# EAGLE design fameboy_button_pads (EAGLE 7.6.0)
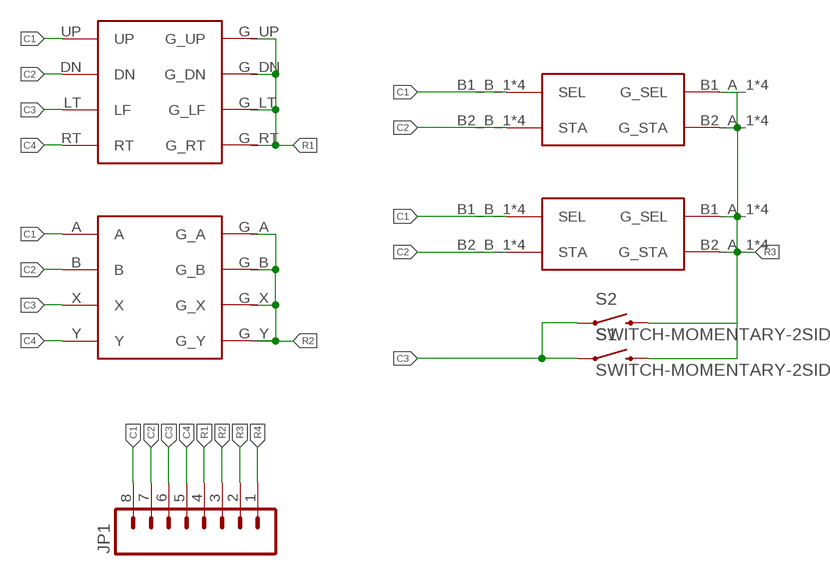
[diagram p0: schematic, sheet 1]

## Parts
JP1  M08  [1X08_ROUND]
S1  SWITCH-MOMENTARY-2SIDE  [TACTILE-PTH-SIDE]
S2  SWITCH-MOMENTARY-2SIDE  [TACTILE-PTH-SIDE]
U$1  DPADGAMEBOY_CLASSIC_DPAD  [DPAD]
U$2  BAXY  [ABXY]
U$3  SELECTSTART  [SELECTSTART]
U$4  SELECTSTART  [SELECTSTART]

## Nets
C1: JP1.8 U$1.UP U$2.A U$3.B1_B_1(SEL) U$3.B1_B_2(SEL) U$3.B1_B_3(SEL) U$3.B1_B_4(SEL) U$4.B1_B_1(SEL) U$4.B1_B_2(SEL) U$4.B1_B_3(SEL) U$4.B1_B_4(SEL)
C2: JP1.7 U$1.DN U$2.B U$3.B2_B_1(STA) U$3.B2_B_2(STA) U$3.B2_B_3(STA) U$3.B2_B_4(STA) U$4.B2_B_1(STA) U$4.B2_B_2(STA) U$4.B2_B_3(STA) U$4.B2_B_4(STA)
C3: JP1.6 S1.1 S2.1 U$1.LT(LF) U$2.X
C4: JP1.5 U$1.RT U$2.Y
R1: JP1.4 U$1.G_DN U$1.G_LT(G_LF) U$1.G_RT U$1.G_UP
R2: JP1.3 U$2.G_A U$2.G_B U$2.G_X U$2.G_Y
R3: JP1.2 S1.2 S2.2 U$3.B1_A_1(G_SEL) U$3.B1_A_2(G_SEL) U$3.B1_A_3(G_SEL) U$3.B1_A_4(G_SEL) U$3.B2_A_1(G_STA) U$3.B2_A_2(G_STA) U$3.B2_A_3(G_STA) U$3.B2_A_4(G_STA) U$4.B1_A_1(G_SEL) U$4.B1_A_2(G_SEL) U$4.B1_A_3(G_SEL) U$4.B1_A_4(G_SEL) U$4.B2_A_1(G_STA) U$4.B2_A_2(G_STA) U$4.B2_A_3(G_STA) U$4.B2_A_4(G_STA)
R4: JP1.1

## Library data of the parts
JP1 = SparkFun-Connectors:M08: Header 8 Standard 8-pin 0.1" header. Use with straight break away headers (SKU : PRT-00116), right angle break away headers (PRT-00553), swiss pins (PRT-00743), machine pins (PRT-00117), and female headers (PRT-00115).
S1 S2 = SparkFun-Electromechanical:SWITCH-MOMENTARY-2: Various NO switches- pushbuttons, reed, etc
U$1 = parts:DPAD
U$2 = parts:BAXY
U$3 U$4 = parts:SELECTSTART

## Board
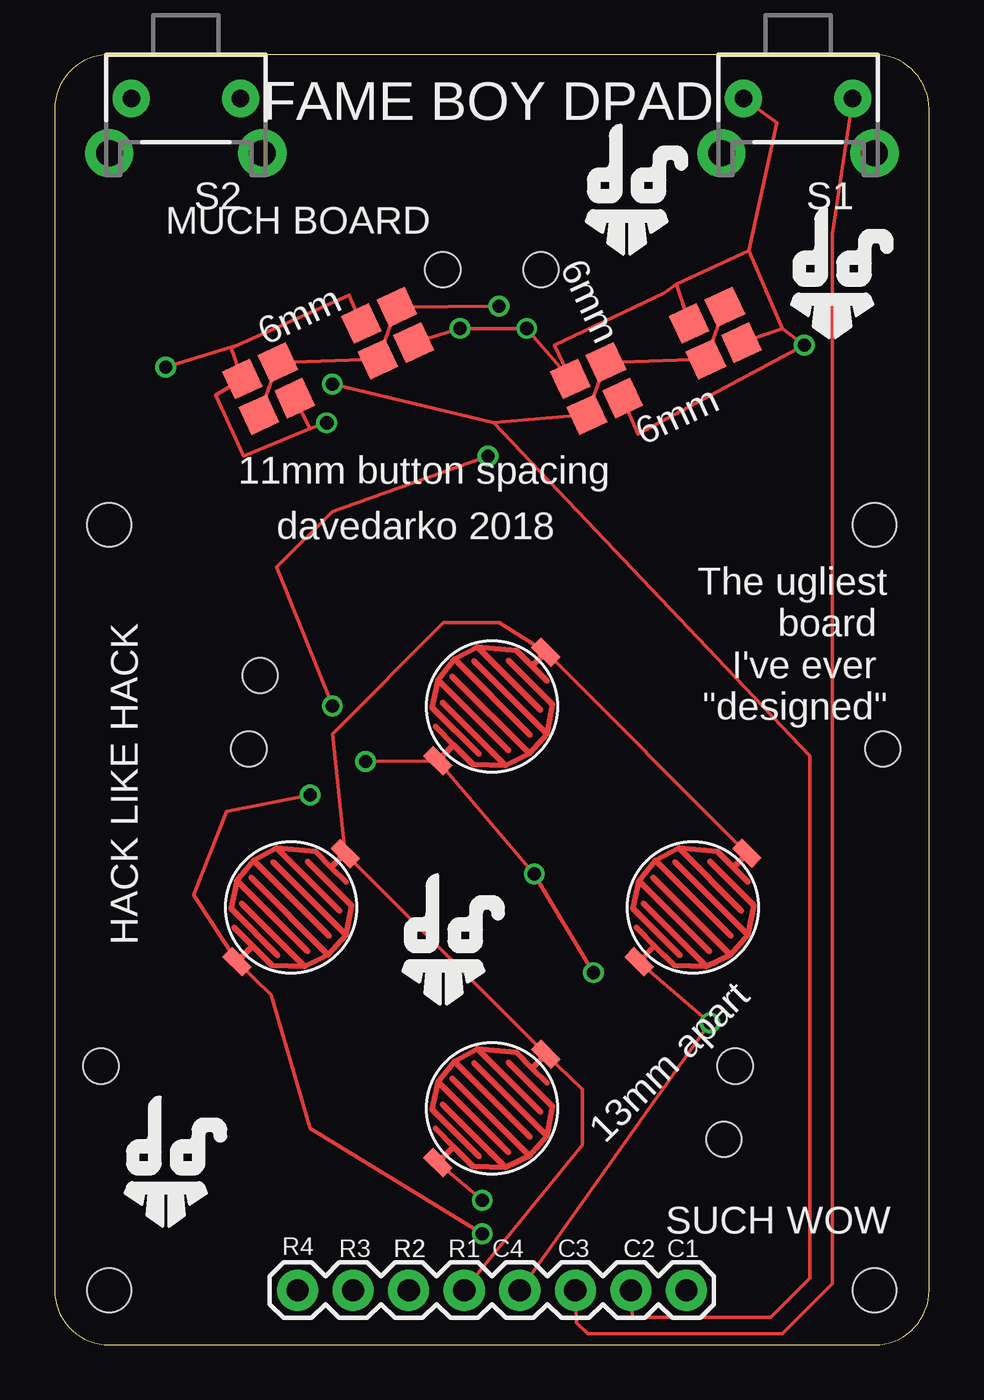
[diagram p1: board, top side]
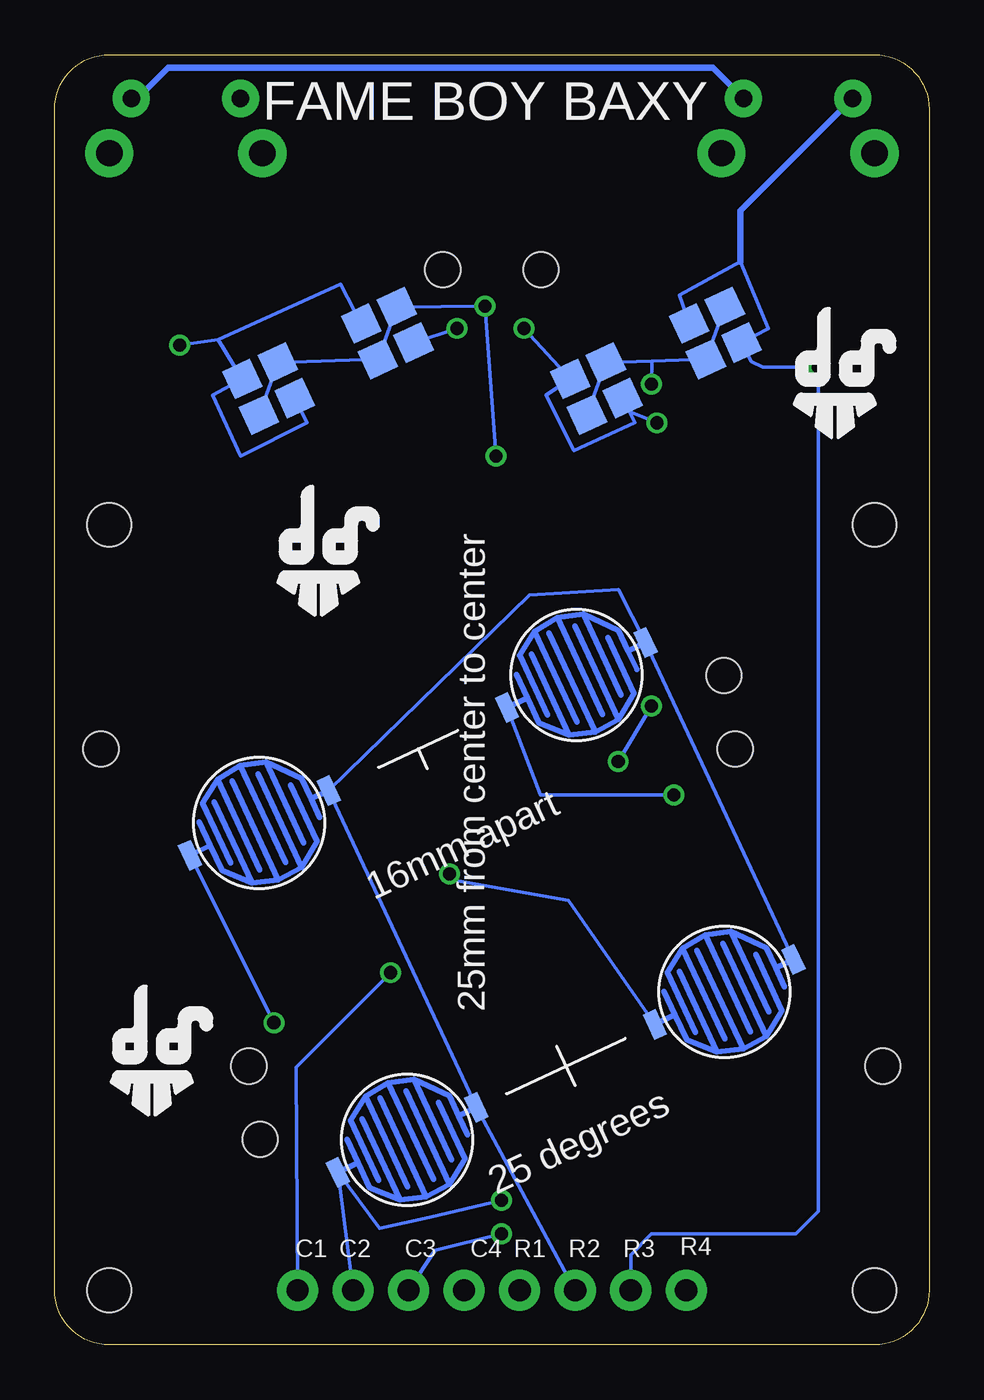
[diagram p2: board, bottom side, seen from below]

Size 40 x 59 mm. Coordinates in mm from the lower left corner, seen from the top.
Outline: 40,2.5 40,56.5 arc90 37.5,59 2.5,59 arc90 0,56.5 0,2.5 arc90 2.5,0 37.5,0 arc90 40,2.5
Copper layers (1*16): Top 0.0356mm / dielectric 1.5011mm / Bottom 0.0356mm
Design rules "LaenPCBOrder *": minimum track width 6mil, minimum drill 13mil, track to track 6mil, track to pad 6mil, pad to pad 6mil, via to via 6mil, smd to smd 6mil, copper to edge 15mil, drill to drill 6mil, minimum pad ring 7mil, minimum via ring 7mil, stop-mask expansion 3mil, vias tented up to drill 200mil, thermal gap 10mil
Holes 2 mm at 2.5,2.5 37.5,2.5 2.5,37.5 37.5,37.5

### Footprints (pad centres in the part's own frame; a part is rotated, then mirrored left to right if it is on the bottom)
1X08_ROUND = drill 1.016 pad 1.88: 1 0,0; 2 2.54,0; 3 5.08,0; 4 7.62,0; 5 10.16,0; 6 12.7,0; 7 15.24,0; 8 17.78,0
TACTILE-PTH-SIDE = drill 0.8 pad 1.7: 1 -2.5,0; 2 2.5,0 | drill 1.2 pad 2.2: ANCHOR1 -3.5,2.5; ANCHOR2 3.5,2.5
DPAD = smd 1.27 x 0.635 rotated 135: DN -2.468,-11.674; G_DN 2.468,-6.71; G_RT 11.66,2.482; G_UP 2.468,11.674; LT -11.66,-2.482; RT 6.725,-2.482; UP -2.468,6.71 | smd 1.27 x 0.635 rotated 315: G_LT -6.71,2.468 | hole 1.6: -10.607,10.607; 10.607,-10.607
ABXY = smd 1.27 x 0.635 rotated 115: A 7.454,-5.352; B -7.047,-12.114; G_A 13.79,-2.376; G_B -0.711,-9.138; G_X 7.028,12.125; X 0.692,9.149; Y -13.809,2.387 | smd 1.27 x 0.635 rotated 295: G_Y -7.465,5.345 | hole 1.6: 17.881,-7.25; -11.119,-7.25; -17.881,7.25; 11.119,7.25
SELECTSTART = smd 1.397 x 1.397 rotated 25: B1_A_1 -11.415,-0.833; B1_A_2 -9.023,-1.703; B1_A_3 -5.977,1.703; B1_A_4 -3.585,0.833; B1_B_1 -9.784,-0.072; B1_B_2 -10.654,-2.464; B1_B_3 -4.346,2.464; B1_B_4 -5.216,0.072; B2_A_1 3.585,-0.833; B2_A_2 5.977,-1.703; B2_A_3 9.023,1.703; B2_A_4 11.415,0.833; B2_B_1 5.216,-0.072; B2_B_2 4.346,-2.464; B2_B_3 9.784,0.072; B2_B_4 10.654,2.464 | hole 1.6: 2.245,4.17

### Placement (x,y rotation side)
JP1  11.11,2.5 0 top
S1  34,57 180 top
S2  6,57 180 top
U$1  20,20 0 top
U$2  20,20 0 bottom
U$3  20,45 0 top
U$4  20,45 0 bottom
U$5  [DAVEDARKO2_LOGO]  35.56,12.7 0 bottom
U$6  [DAVEDARKO2_LOGO]  5.08,7.62 0 top
U$7  [DAVEDARKO2_LOGO]  35.56,48.26 0 top
U$8  [DAVEDARKO2_LOGO]  4.32,43.69 0 bottom
U$9  [DAVEDARKO2_LOGO]  27.94,35.56 0 bottom
U$10  [DAVEDARKO2_LOGO]  17.78,17.78 0 top
U$11  [DAVEDARKO2_LOGO]  26.16,52.07 0 top

### Tracks (layer width: path | path; a pad name or v marks a point on that pad's centre or on a via)
C1  (via drill 0.6)
  Top 0.152: U$3.B1_B_2 U$3.B1_B_1 U$3.B1_B_4 U$3.B1_B_3 v20.32,47.5 | v24.64,17.02 v21.93,21.54 U$1.UP v14.22,26.67 | v12.7,29.21 10.16,35.56 12.7,38.1 v19.81,40.64
  Bottom 0.152: U$4.B1_B_2 U$4.B1_B_1 U$4.B1_B_4 U$4.B1_B_3 v20.32,47.5 v19.81,40.64 | JP1.8 28.96,12.7 v24.64,17.02 | v21.93,21.54 21.55,21.23 16.51,20.32 U$2.A | v14.22,26.67 v12.7,29.21
C2  (via drill 0.6)
  Top 0.152: U$3.B2_B_4 U$3.B2_B_3 U$3.B2_B_1 U$3.B2_B_2 20.07,42.16 | 20.07,42.16 v12.7,43.94 | 20.07,42.16 34.54,26.92 34.54,3.05 32.77,1.27 26.42,1.27 JP1.7 | v19.56,6.6 U$1.DN
  Bottom 0.152: U$4.B2_B_4 U$4.B2_B_3 12.68,44.99 | 12.68,44.99 U$4.B2_B_1 U$4.B2_B_2 | v12.7,43.94 12.68,44.99 | JP1.7 U$2.B 25.15,5.33 22.86,5.84 v19.56,6.6
C3  (via drill 0.6)
  Top 0.152: S1.1 35.56,50.8 35.56,2.79 33.27,0.51 24.38,0.51 23.88,1.02 JP1.6 | v19.56,5.08 11.68,9.91 9.91,16 U$1.LT 6.35,20.57 7.87,24.38 v11.68,25.15
  Bottom 0.152: JP1.6 22.61,4.32 v19.56,5.08 | v11.68,25.15 17.78,25.15 U$2.X
  Bottom 0.305: S2.1 9.9,58.4 34.8,58.4 36.2,57 S1.1
C4  (via drill 0.6)
  Top 0.152: U$1.RT v29.97,14.73 JP1.5
  Bottom 0.152: U$2.Y v29.97,14.73
R1
  Top 0.152: U$1.G_RT U$1.G_UP 20.32,33.02 17.78,33.02 12.7,27.94 U$1.G_LT U$1.G_DN 24.13,11.68 24.13,9.14 JP1.4
R2
  Bottom 0.152: U$2.G_A U$2.G_X 14.22,34.54 18.29,34.29 U$2.G_Y U$2.G_B JP1.3
R3  (via drill 0.6)
  Top 0.152: 8.36,45.71 8.08,45.58 U$3.B1_A_1 7.37,43.43 8.64,40.64 11.68,41.91 | 8.36,45.71 13.46,48.01 U$3.B1_A_3 | U$3.B1_A_2 11.68,41.91 | v5.08,44.7 8.36,45.71 | U$3.B2_A_4 33.27,46.48 | 33.27,46.48 31.75,50.04 | 31.75,50.04 28.45,48.51 | 28.45,48.51 U$3.B2_A_3 | 33.27,46.48 v34.29,45.72 26.67,41.66 U$3.B2_A_2 | 11.68,41.91 v12.45,42.16 | U$3.B1_A_4 v18.54,46.48 v21.59,46.48 U$3.B2_A_1 22.86,45.72 27.86,48.09 28.45,48.51 | S1.2 33.02,55.88 31.75,50.04
  Bottom 0.152: U$4.B1_A_2 28.45,42.16 31.5,40.64 32.77,43.43 U$4.B1_A_1 32.51,45.97 | U$4.B2_A_3 11.43,48.01 8.64,49.53 7.37,46.48 U$4.B2_A_4 8.13,44.96 7.62,44.7 v5.08,44.7 5.08,6.1 6.1,5.08 12.7,5.08 13.65,4.13 JP1.2 | U$4.B2_A_2 13.72,42.68 | 13.72,42.68 13.46,42.16 16.26,40.89 17.53,43.43 U$4.B2_A_1 v18.54,46.48 | U$4.B1_A_3 26.92,48.51 32.51,45.97 | v34.29,45.72 32.51,45.97 | v12.45,42.16 13.72,42.68 | U$4.B1_A_4 v21.59,46.48
  Bottom 0.305: S2.2 8.64,51.86 8.64,49.53

### Text on the board
tNames: FAME BOY DPAD | MUCH BOARD | 6mm | 6mm | 6mm | 11mm button spacing | davedarko 2018 | The ugliest / board / I've ever / "designed" | HACK LIKE HACK | 13mm apart | SUCH WOW | R4 | R3 | R2 | R2 | R1 | C4 | C3 | C2 | C2 | C1
bNames: FAME BOY BAXY | 16mm apart | 25mm from center to center | 25 degrees | R4 | R3 | R2 | R1 | C4 | C3 | C2 | C1